# EAGLE schematic ms20_vcf (EAGLE 7.1.0)
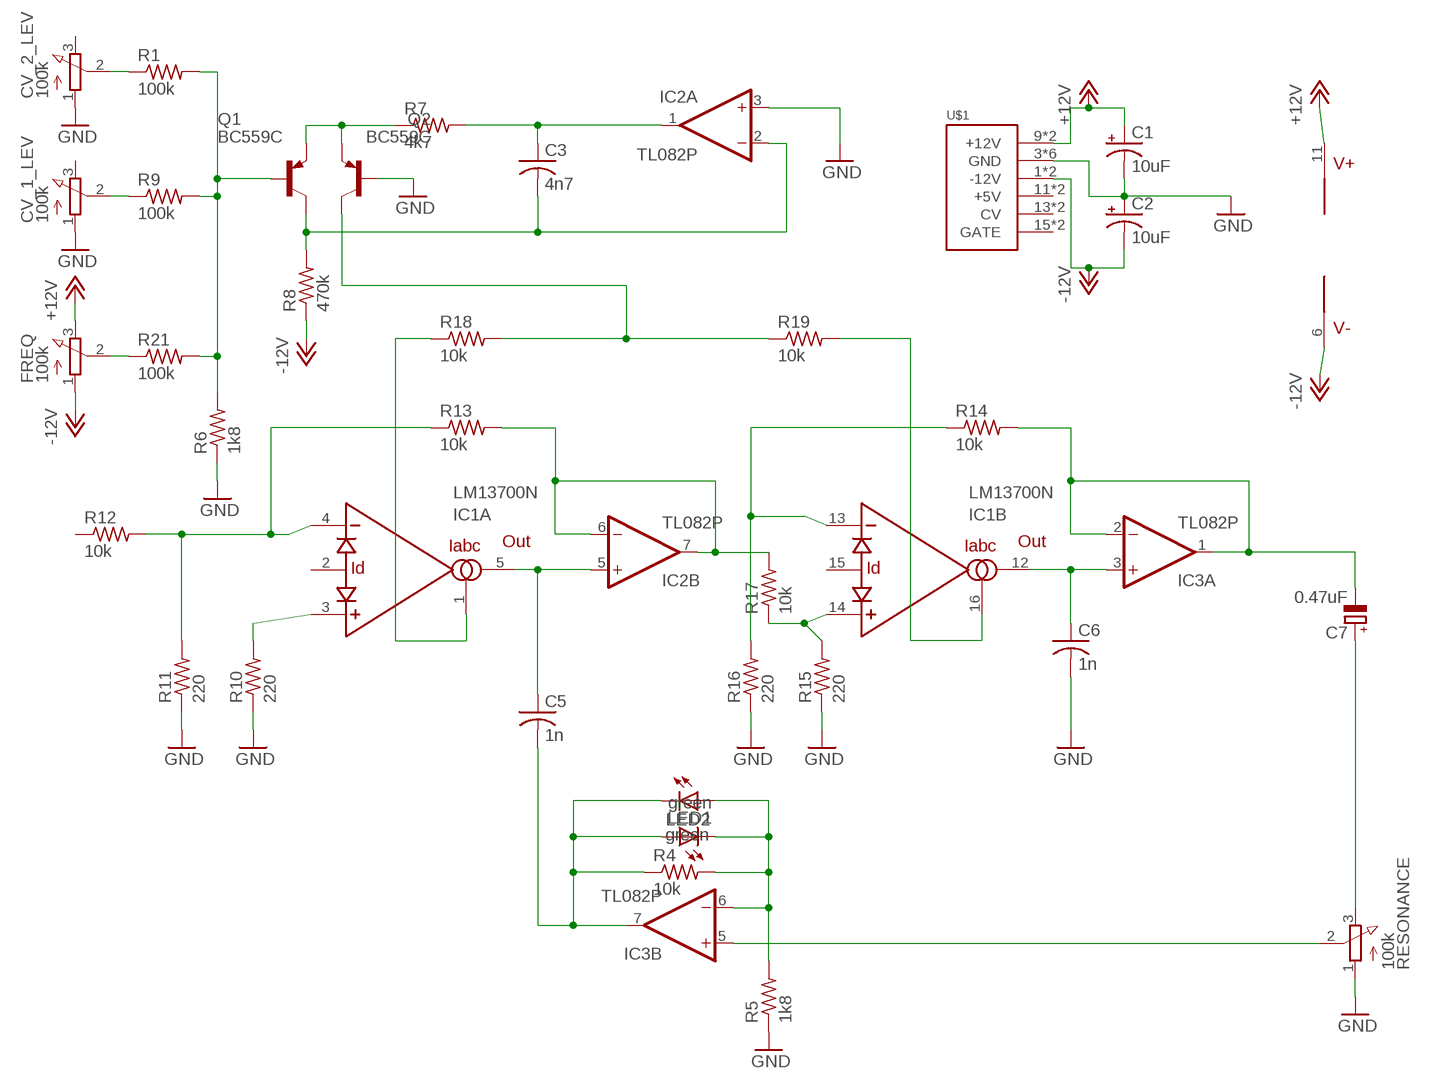
[diagram p0: schematic, sheet 1]

## Parts
C1  10uF  CPOL-USB45181A  [B45181A]
C2  10uF  CPOL-USB45181A  [B45181A]
C3  4n7  C-US050-024X044  [C050-024X044]
C5  1n  C-US050-024X044  [C050-024X044]
C6  1n  C-US050-024X044  [C050-024X044]
C7  0.47uF  CPOL-EUB45181A  [B45181A]
CV_1_LEV  100k  3RP/1610N  [3RP/1610N]
CV_2_LEV  100k  3RP/1610N  [3RP/1610N]
FREQ  100k  3RP/1610N  [3RP/1610N]
IC1  LM13700N  [DIL16]
IC2  TL082P  [DIL08]
IC3  TL082P  [DIL08]
LED1  green  LED5MM  [LED5MM]
LED2  green  LED5MM  [LED5MM]
Q1  BC559C  [TO92-EBC]
Q2  BC559C  [TO92-EBC]
R1  100k  R-US_0207/10  [0207/10]
R4  10k  R-US_0207/10  [0207/10]
R5  1k8  R-US_0207/10  [0207/10]
R6  1k8  R-US_0207/10  [0207/10]
R7  4k7  R-US_0207/10  [0207/10]
R8  470k  R-US_0207/10  [0207/10]
R9  100k  R-US_0207/10  [0207/10]
R10  220  R-US_0207/10  [0207/10]
R11  220  R-US_0207/10  [0207/10]
R12  10k  R-US_0207/10  [0207/10]
R13  10k  R-US_0207/10  [0207/10]
R14  10k  R-US_0207/10  [0207/10]
R15  220  R-US_0207/10  [0207/10]
R16  220  R-US_0207/10  [0207/10]
R17  10k  R-US_0207/10  [0207/10]
R18  10k  R-US_0207/10  [0207/10]
R19  10k  R-US_0207/10  [0207/10]
R21  100k  R-US_0207/10  [0207/10]
RESONANCE  100k  3RP/1610N  [3RP/1610N]
U$1  POWER  [POWER_16]

## Nets
+12V: C1.+ FREQ.3(E) IC1.11(V+) U$1.9(+12V) U$1.10(+12V)
-12V: C2.- FREQ.1(A) IC1.6(V-) R8.1 U$1.1(-12V) U$1.2(-12V)
GND: C1.- C2.+ C6.2 CV_1_LEV.1(A) CV_2_LEV.1(A) IC2.3(A:+IN) Q2.B R5.1 R6.1 R10.1 R11.1 R15.1 R16.1 RESONANCE.1(A) U$1.3(GND) U$1.4(GND) U$1.5(GND) U$1.6(GND) U$1.7(GND) U$1.8(GND)
N$1: IC3.6(B:-IN) LED1.K(C) LED2.A R4.2 R5.2
N$2: C5.2 IC3.7(B:OUT) LED1.A LED2.K(C) R4.1
N$3: C3.2 IC2.2(A:-IN) Q1.C R8.2
N$4: C3.1 IC2.1(A:OUT) R7.2
N$5: Q1.E Q2.E R7.1
N$6: IC3.5(B:+IN) RESONANCE.2(S)
N$7: CV_2_LEV.2(S) R1.1
N$8: CV_1_LEV.2(S) R9.1
N$9: C5.1 IC1.5(A:OUT) IC2.5(B:+IN)
N$10: C6.1 IC1.12(B:OUT) IC3.3(A:+IN)
N$11: C7.- IC3.1(A:OUT) IC3.2(A:-IN) R14.2
N$12: C7.+ RESONANCE.3(E)
N$13: IC1.1(A:IABC) R18.1
N$14: IC1.4(A:-IN) R11.2 R12.2 R13.1
N$15: IC1.3(A:+IN) R10.2
N$16: Q2.C R18.2 R19.1
N$17: IC1.16(B:IABC) R19.2
N$18: IC1.13(B:-IN) R14.1 R16.2
N$19: IC2.6(B:-IN) IC2.7(B:OUT) R13.2 R17.2
N$20: IC1.14(B:+IN) R15.2 R17.1
N$21: Q1.B R1.2 R6.2 R9.2 R21.2
N$22: FREQ.2(S) R21.1
Unconnected: CV_1_LEV.3(E) CV_2_LEV.3(E) IC1.2(A:ID) IC1.7(IN) IC1.8(OUT) IC1.9(OUT) IC1.10(IN) IC1.15(B:ID) R12.1 U$1.11(+5V) U$1.12(+5V) U$1.13(CV) U$1.14(CV) U$1.15(GATE) U$1.16(GATE)

## Power pins joined to a net without a drawn wire
V+: IC2.8(P:V+) IC3.8(P:V+)
V-: IC2.4(P:V-) IC3.4(P:V-)

## Library data of the parts
C1 C2 = rcl:CPOL-US: POLARIZED CAPACITOR, American symbol
C3 C5 C6 = rcl:C-US: CAPACITOR, American symbol
C7 = rcl:CPOL-EU: POLARIZED CAPACITOR, European symbol
CV_1_LEV CV_2_LEV FREQ RESONANCE = pot:3RP/1610N: 16mm Potentiometer one level Source: http://www.alphapotentiometers.net/html/16mm_pot_2.html
IC1 = synthdiy:LM13700: National Dual OTA with buffers.
IC2 IC3 = linear:TL082: OP AMP Data sheet <http://www.ti.com/lit/ds/symlink/tl084a . pdf>; DATA_SHEET: <a href="http://www.ti.com/lit/ds/symlink/tl084a.pdf"> Data sheet </a>
LED1 LED2 = led:LED: LED OSRAM: - CHIPLED LG R971, LG N971, LY N971, LG Q971, LY Q971, LO R971, LY R971 LH N974, LH R974 LS Q976, LO Q976, LY Q976 LO Q996 - Hyper CHIPLED LW Q18S LB Q993, LB Q99A, LB R99A - SideLED LS A670, LO A670, LY A670, LG A670, LP A670 LB A673, LV A673, LT A673, LW A673 LH A674 LY A675 LS A676, LA A676, LO A676, LY A676, LW A676 LS A679, LY A679, LG A679 - Hyper Micro SIDELED® LS Y876, LA Y876, LO Y876, LY Y876 LT Y87S - SmartLED LW L88C, LW L88S LB L89C, LB L89S, LG L890 LS L89K, LO L89K, LY L89K LS L896, LA L896, LO L896, LY L896 - TOPLED LS T670, LO T670, LY T670, LG T670, LP T670 LSG T670, LSP T670, LSY T670, LOP T670, LYG T670 LG T671, LOG T671, LSG T671 LB T673, LV T673, LT T673, LW T673 LH T674 LS T676, LA T676, LO T676, LY T676, LB T676, LH T676, LSB T676, LW T676 LB T67C, LV T67C, LT T67C, LS T67K, LO T67K, LY T67K, LW E67C LS E67B, LA E67B, LO E67B, LY E67B, LB E67C, LV E67C, LT E67C LW T67C LS T679, LY T679, LG T679 LS T770, LO T770, LY T770, LG T770, LP T770 LB T773, LV T773, LT T773, LW T773 LH T774 LS E675, LA E675, LY E675, LS T675 LS T776, LA T776, LO T776, LY T776, LB T776 LHGB T686 LT T68C, LB T68C - Hyper Mini TOPLED® LB M676 - Mini TOPLED Santana® LG M470 LS M47K, LO M47K, LY M47K Source: http://www.osram.convergy.de LUXEON: - LUMILED® LXK2-PW12-R00, LXK2-PW12-S00, LXK2-PW14-U00, LXK2-PW14-V00 LXK2-PM12-R00, LXK2-PM12-S00, LXK2-PM14-U00 LXK2-PE12-Q00, LXK2-PE12-R00, LXK2-PE12-S00, LXK2-PE14-T00, LXK2-PE14-U00 LXK2-PB12-K00, LXK2-PB12-L00, LXK2-PB12-M00, LXK2-PB14-N00, LXK2-PB14-P00, LXK2-PB14-Q00 LXK2-PR12-L00, LXK2-PR12-M00, LXK2-PR14-Q00, LXK2-PR14-R00 LXK2-PD12-Q00, LXK2-PD12-R00, LXK2-PD12-S00 LXK2-PH12-R00, LXK2-PH12-S00 LXK2-PL12-P00, LXK2-PL12-Q00, LXK2-PL12-R00 Source: www.luxeon.com KINGBRIGHT: KA-3528ASYC Source: www.kingbright.com
Q1 Q2 = transistor-pnp:BC559*: PNP Transistror
R1 R4-R19 R21 = rcl:R-US_: RESISTOR, American symbol
U$1 = eurorack:POWER